# Altium schematic sheet MelansonTech Boost PSU_IsolatedShuntAmp.SchDoc
size B
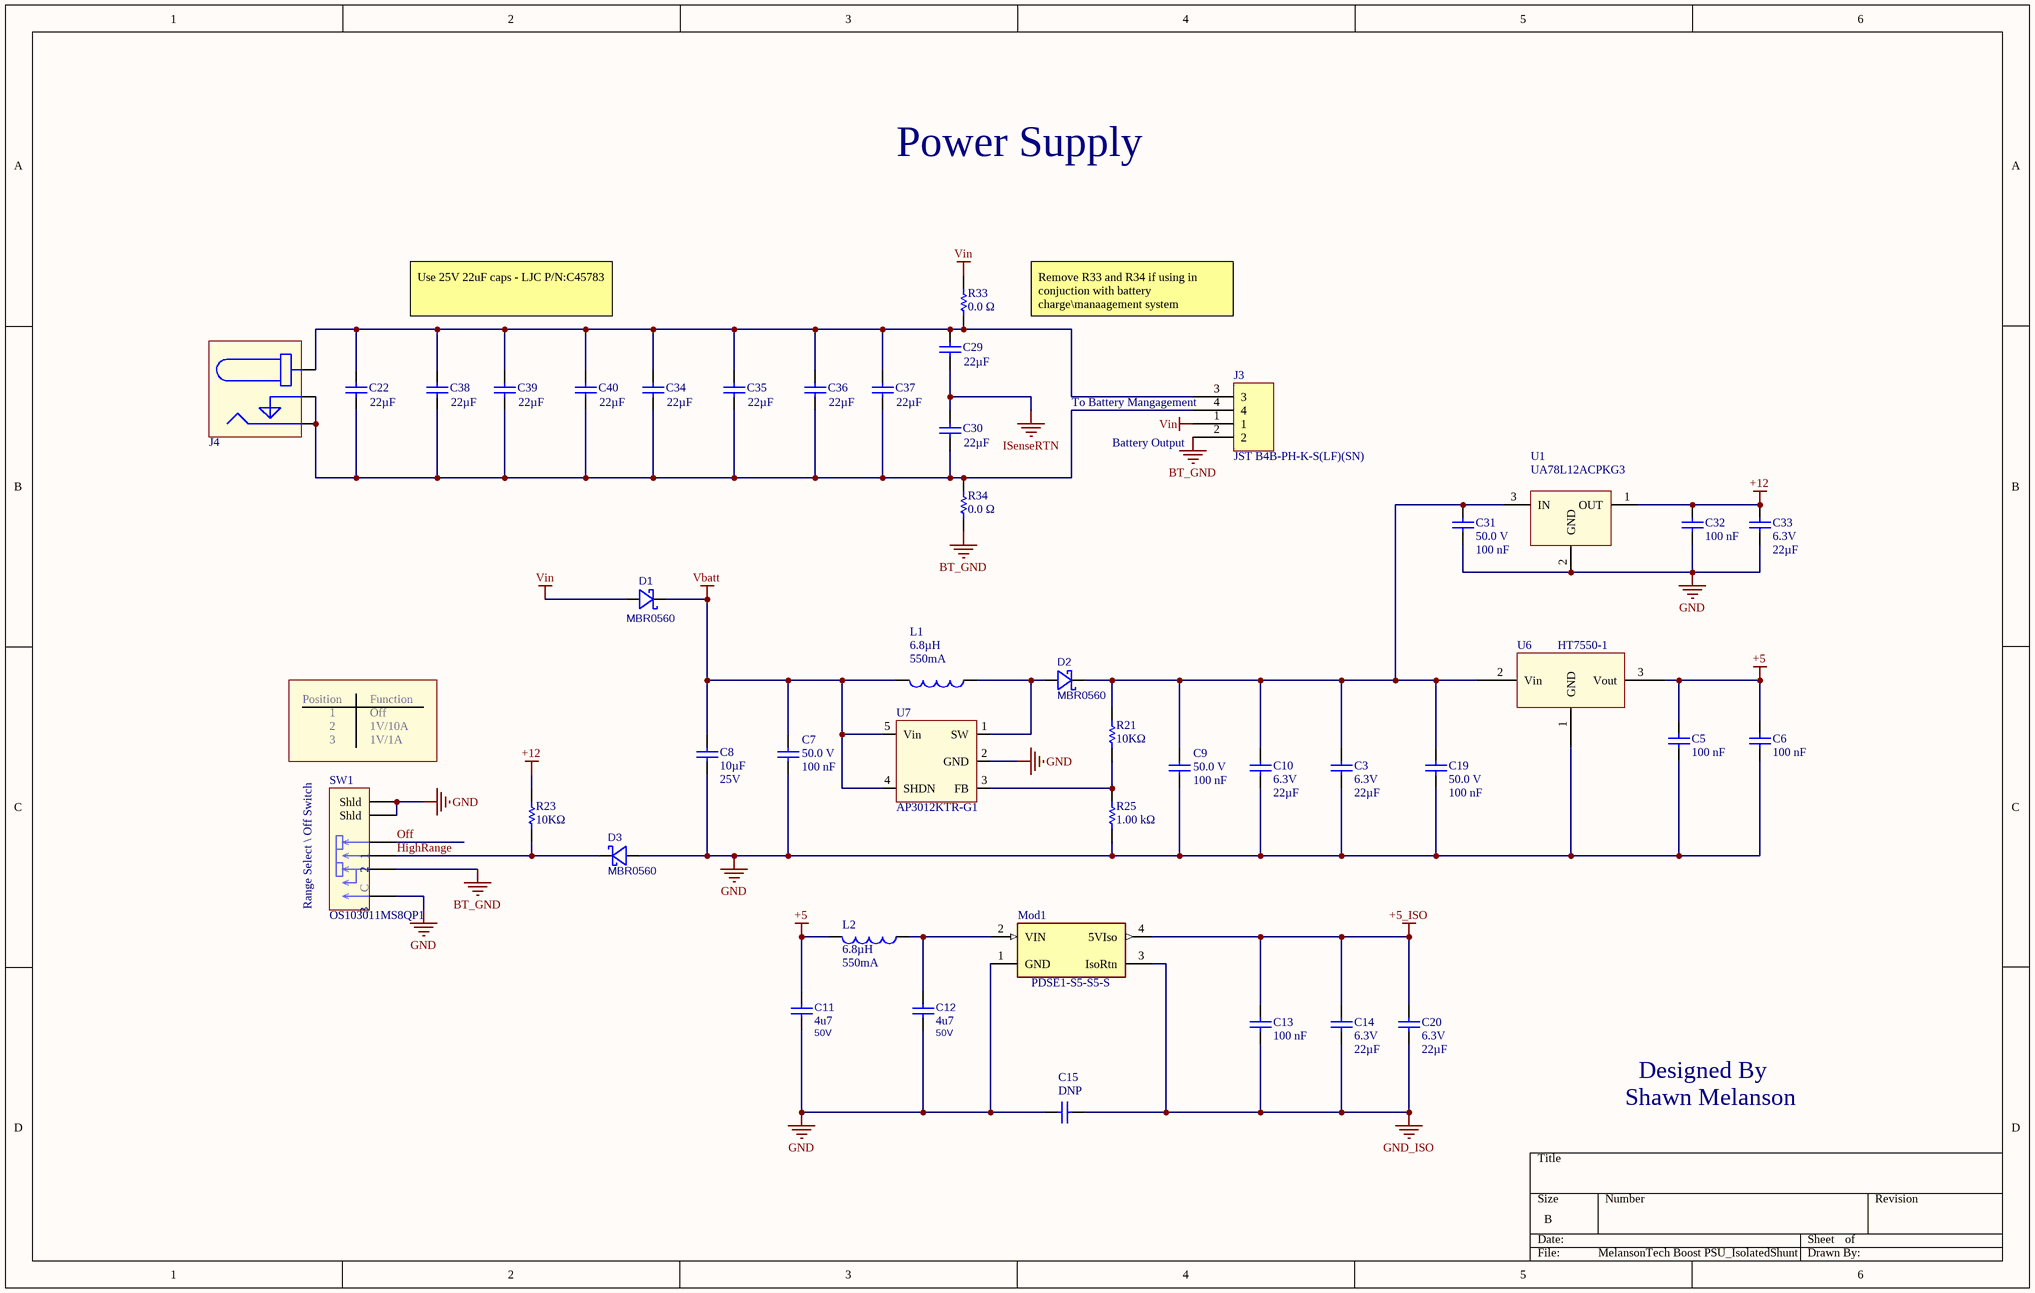
[diagram p0: MelansonTech Boost PSU_IsolatedShuntAmp.SchDoc]

## Parts
C3  Voltage - Rated: 6.3V  Capacitance: 22µF  [Cap,0805]  (hidden comment: CL21A226MQQNNNE)
C5  Capacitance: 100 nF  [CAP, 0805, HD]  (hidden comment: 08055C104JAT2A)
C6  Capacitance: 100 nF  [CAP, 0805, HD]  (hidden comment: 08055C104JAT2A)
C7  Voltage Rating (DC): 50.0 V  Capacitance: 100 nF  [Cap,0805]  (hidden comment: Cap)
C8  Capacitance: 10µF  Voltage - Rated: 25V  [Cap, 1206]  (hidden comment: C3216X7R1E106K160AB)
C9  Voltage Rating (DC): 50.0 V  Capacitance: 100 nF  [Cap,0805]  (hidden comment: Cap)
C10  Voltage - Rated: 6.3V  Capacitance: 22µF  [Cap,0805]  (hidden comment: CL21A226MQQNNNE)
C11  Capacitance: 4u7  Voltage: 50V  [Cap, 1206]  (hidden comment: CL31B475KBHNNNE)
C12  Capacitance: 4u7  Voltage: 50V  [Cap, 1206]  (hidden comment: CL31B475KBHNNNE)
C13  Capacitance: 100 nF  [CAP, 0805, HD]  (hidden comment: 08055C104JAT2A)
C14  Voltage - Rated: 6.3V  Capacitance: 22µF  [Cap,0805]  (hidden comment: CL21A226MQQNNNE)
C15  S102K33Y5PP63K5R  [Cap, 5mm Lead Spaceing, 4mm dai]  (value not drawn)
C19  Voltage Rating (DC): 50.0 V  Capacitance: 100 nF  [Cap,0805]  (hidden comment: Cap)
C20  Voltage - Rated: 6.3V  Capacitance: 22µF  [Cap,0805]  (hidden comment: CL21A226MQQNNNE)
C22  Capacitance: 22µF  [Cap,0805]  (hidden comment: CL21A226MQQNNNE)
C29  Capacitance: 22µF  [Cap,0805]  (hidden comment: CL21A226MQQNNNE)
C30  Capacitance: 22µF  [Cap,0805]  (hidden comment: CL21A226MQQNNNE)
C31  Voltage Rating (DC): 50.0 V  Capacitance: 100 nF  [Cap,0805]  (hidden comment: Cap)
C32  Capacitance: 100 nF  [CAP, 0805, HD]  (hidden comment: 08055C104JAT2A)
C33  Voltage - Rated: 6.3V  Capacitance: 22µF  [Cap,0805]  (hidden comment: CL21A226MQQNNNE)
C34  Capacitance: 22µF  [Cap,0805]  (hidden comment: CL21A226MQQNNNE)
C35  Capacitance: 22µF  [Cap,0805]  (hidden comment: CL21A226MQQNNNE)
C36  Capacitance: 22µF  [Cap,0805]  (hidden comment: CL21A226MQQNNNE)
C37  Capacitance: 22µF  [Cap,0805]  (hidden comment: CL21A226MQQNNNE)
C38  Capacitance: 22µF  [Cap,0805]  (hidden comment: CL21A226MQQNNNE)
C39  Capacitance: 22µF  [Cap,0805]  (hidden comment: CL21A226MQQNNNE)
C40  Capacitance: 22µF  [Cap,0805]  (hidden comment: CL21A226MQQNNNE)
D1  MBR0560  [SOD123]
D2  MBR0560  [SOD123]
D3  MBR0560  [SOD123]
J3  JST B4B-PH-K-S(LF)(SN)  [Conn, JST, 4 pin, 2mm spacing Right Angle]
J4  PJ-002A  [Connector,Barrel,2.1mm,5.5mm,DC power Jack]  (value not drawn)
L1  Inductance: 6.8µH  Current Rating (Amps): 550mA  [Ind, 0805]  (hidden comment: MLZ2012N6R8LT000)
L2  Inductance: 6.8µH  Current Rating (Amps): 550mA  [Ind, 0805]  (hidden comment: MLZ2012N6R8LT000)
Mod1  PDSE1-S5-S5-S  [CONV_PDSE1-S5-S5-S]
R21  Resistance: 10KΩ  [res, 0805, HD]  (hidden comment: Vishay / Dale CRCW080510K0FKTA)
R23  Resistance: 10KΩ  [res, 0805, HD]  (hidden comment: Vishay / Dale CRCW080510K0FKTA)
R25  Resistance: 1.00 kΩ  [res, 0805, HD]  (hidden comment: Vishay CRCW08051K00JNEA)
R33  Resistance: 0.0 Ω  [res, 0805, HD]  (hidden comment: CR0805-J/-000ELF)
R34  Resistance: 0.0 Ω  [res, 0805, HD]  (hidden comment: CR0805-J/-000ELF)
SW1  OS103011MS8QP1  [Switch,Slide,.SP3T, OS103011 -Side]
U1  UA78L12ACPKG3  [SOT89-3]
U6  HT7550-1  [SOT89-3]
U7  AP3012KTR-G1  [SOT23-5]

## Nets
+5: C5.2 C6.2 C11.2 L2.2 U6.3(Vout)
+5_ISO: C13.2 C14.2 C20.2 Mod1.4(5VIso)
+12: C32.2 C33.2 R23.1 U1.1(OUT)
BT_GND: J3.2 R34.2 SW1.2
GND: C3.1 C5.1 C6.1 C7.1 C8.1 C9.1 C10.1 C11.1 C12.1 C15.2 C19.1 C31.1 C32.1 C33.1 D3.2(A) Mod1.1(GND) R25.2 SW1.1 SW1.5(Shld) SW1.6(Shld) U1.2(GND) U6.1(GND) U7.2(GND)
GND_ISO: C13.1 C14.1 C15.1 C20.1 Mod1.3(IsoRtn)
ISenseRTN: C29.1 C30.2
Vbatt: C7.2 C8.2 D1.1(C) L1.2 U7.4(SHDN) U7.5(Vin)
Vin: D1.2(A) J3.1 R33.1
HighRange: D3.1(C) R23.2 SW1.3
Off: SW1.4
NetC3_2: C3.2 C9.2 C10.2 C19.2 C31.2 D2.1(C) R21.2 U1.3(IN) U6.2(Vin)
NetC12_2: C12.2 L2.1 Mod1.2(VIN)
NetC22_1: C22.1 C30.1 C34.1 C35.1 C36.1 C37.1 C38.1 C39.1 C40.1 J3.4 J4.2 J4.3 R34.1
NetC22_2: C22.2 C29.2 C34.2 C35.2 C36.2 C37.2 C38.2 C39.2 C40.2 J3.3 J4.1 R33.2
NetD2_2: D2.2(A) L1.1 U7.1(SW)
NetR21_1: R21.1 R25.1 U7.3(FB)

## Notes on the sheet
- Power Supply
- Use 25V 22uF caps - LJC P/N:C45783
- Remove R33 and R34 if using in conjuction with battery charge\manaagement system
- (near J3) To Battery Mangagement
- (near J3) Battery Output
- Position
- Function
- 1
- 2
- 3
- Off
- 1V/10A
- 1V/1A
- Range Select \ Off Switch
- (near C15) DNP
- Shawn Melanson
- Designed By
- (in symbol Switch,TH,Slide,SP3T,100MA,12V,OS103011MS8QP1) C

## Library data of the parts
C3 C10 C14 C20 C22 C29 C30 C33-C40 = Cap,0805,22uF,6.3V,X5R,±20%,CL21A226MQQNNNE: CAP CER 22UF 6.3V X5R 0805; Manufacturer: Samsung Electro-Mechanics; Detailed Description: 22 µF ±20% 6.3V Ceramic Capacitor X5R 0805 (2012 Metric); Tolerance: ±20%; mfg P/N: CL21A226MQQNNNE; Category: Capacitors  Ceramic Capacitors; Series: CL; Part Status: Active; Temperature Coefficient: X5R; Operating Temperature: -55°C ~ 85°C; Applications: General Purpose; Mounting Type: Surface Mount, MLCC; Package / Case: 0805 (2012 Metric); Size / Dimension: 0.079" L x 0.049" W (2.00mm x 1.25mm); Thickness (Max): 0.055" (1.40mm)
  C22 C29 C30 C34-C40: Voltage - Rated: 6.3V
C5 C6 C13 C32 = Cap,0805,100nf,50V,5%,08055C104JAT2A: Capacitor; Ceramic; Cap 0.1 uF; Tol 5%; Vol-Rtg 50 VDC; SMT; 0805; X7R; Tape & Reel; Lead-Free Status: Lead Free; Voltage Rating (DC): 50.0 V; Case/Package (SI): 2012; Insulation Resistance: 100 GΩ; Detailed Description: 0.1µF ±5% 50V Ceramic Capacitor X7R 0805 (2012 Metric); Mounting Style: Surface Mount; Packaging: Tape & Reel (TR), Cut Tape (CT); RoHS: Compliant; Size-Width: 1.24 mm; Case/Package: 0805; Number of Pins: 2; digikey url: http://www.digikey.ca/product-detail/en/avx-corporation/08055C104JAT2A/478-3352-1-ND/930144; REACH SVHC Compliance: No SVHC; Dielectric Characteristic: X7R; Capacitance Tolerance: ±5%; Size-Length: 2.01 mm; Size-Height: 710 µm; Size-Thickness: 940 µm; Manufacturer Part Number: 08055C104JAT2A; Octopart URL: http://octopart.com/08055c104jat2a-avx-55388010; Operating Temperature: -55°C ~ 125°C
C7 C9 C19 C31 = Cap,0805,100nf,50V,5%,08055C104JAT2A: Capacitor; Ceramic; Cap 0.1 uF; Tol 5%; Vol-Rtg 50 VDC; SMT; 0805; X7R; Tape & Reel; Lead-Free Status: Lead Free; Case/Package (SI): 2012; Insulation Resistance: 100 GΩ; Detailed Description: 0.1µF ±5% 50V Ceramic Capacitor X7R 0805 (2012 Metric); Mounting Style: Surface Mount; Packaging: Tape & Reel (TR), Cut Tape (CT); RoHS: Compliant; Size-Width: 1.24 mm; Case/Package: 0805; Number of Pins: 2; digikey url: http://www.digikey.ca/product-detail/en/avx-corporation/08055C104JAT2A/478-3352-1-ND/930144; REACH SVHC Compliance: No SVHC; Dielectric Characteristic: X7R; Capacitance Tolerance: ±5%; Size-Length: 2.01 mm; Size-Height: 710 µm; Size-Thickness: 940 µm; Manufacturer Part Number: 08055C104JAT2A; Octopart URL: http://octopart.com/08055c104jat2a-avx-55388010; Operating Temperature: -55°C ~ 125°C
C8 = CAP,1206,10uF,25V,C3216X7R1E106K160AB: 10µF ±10% 25V Ceramic Capacitor X7R 1206 (3216 Metric); Manufacturer: TDK Corporation; Features Low: ESL; mfg P/N: C3216X7R1E106K160AB; Tolerance: ±10%; Temperature Coefficient: X7R; Operating Temperature: -55°C ~ 125°C; Applications: General Purpose; Mounting Type: Surface Mount, MLCC; Package / Case: 1206 (3216 Metric); Size / Dimension: 0.126" L x 0.063" W (3.20mm x 1.60mm); Thickness (Max): 0.075" (1.90mm); Supplier 1: Digi-Key; Supplier Part Number 1: 445-7705-1-ND
C11 C12 = Cap,1206,4.7uF,10%,50V,CL31B475KBHNNNE: Cap,SMD,MLCC,4u7,50V,X7R,10%,1206; Manufacturer: Samsung; Manufacturer P/N: CL31B475KBHNNNE; Tolerance: 10%; Package: 1206; Supplier 1: LCSC; Supplier Part Number 1: C51205; Supplier 2: Digi-Key; Supplier Part Number 2: 1276-2789-1-ND
C15 = Cap,TH,Ceramic,5mm Spacing,1nF,2kV, S102K33Y5PP63K5R: CAP CER 1000PF 2KV Y5P RADIAL; Manufacturer: Vishay BC Components; Detailed Description: 1000pF ±10% 2000V (2kV) Ceramic Capacitor Y5P (B) Radial, Disc; Tolerance: ±10%; Temperature Coefficient: Y5P (B); Voltage - Rated: 2000V (2kV); Capacitance: 1nF; mfg P/N: S102K33Y5PP63K5R; Category: Capacitors  Ceramic Capacitors; Series: S; Part Status: Active; Operating Temperature: -30°C ~ 125°C; Applications: General Purpose; Mounting Type: Through Hole; Package / Case: Radial, Disc; Size / Dimension: 0.335"" Dia (8.50mm); Height - Seated (Max): 0.492"" (12.50mm); Lead Spacing: 0.197"" (5.00mm); Lead Style: Formed Leads - Kinked
D1-D3 = Diode,SOD123,Shottky,60V,0.5A,MBR0560: Dio,Sig,Schtky,0.5A,60V,SOD123; Manufacturer: MCC; mfg P/N: MBR0560-TP; Details: 700mV @ 500mA, 200µA @ 60V,30pF @ 4V, 1MHz; Not Stuffed: N/S; Fast Supplier: Digi-Key; Current: 0.5A; Package: SOD123; Voltage: 60V; Supplier 1: Digi-Key; Supplier Part Number 1: MBR0560TPMSCT-ND; Supplier 2: LCSC; Supplier Part Number 2: C150515
J3 = Conntector, though hole, JST, 4pin, 2mm,B4B-PH-K-S(LF)(SN): PH Series 4 Position 2 mm Pitch Through Hole Crimp Top Entry Shrouded Header; Voltage Rating (AC): 100 V; Insulation Resistance: 1.00 MΩ; Number of Contacts: 4; Contact Resistance: 10.0 mΩ; REACH SVHC Compliance: No SVHC; Mounting Style: Through Hole, Vertical; Manufacturer Part Number: B4B-PH-K-S(LF)(SN); Size-Width: 4.50 mm; Number of Positions: 4; Size-Height: 6.00 mm; Size-Length: 9.90 mm; Supplier 1: Farnell; Supplier 2: Newark; Supplier 3: Digi-Key; Supplier 4: Digi-Key; Supplier Part Number 4: 455-1706-ND
J4 = Connector,Barrel,ID 2.1mm,OD 5.5mm,Power Connect, PJ-002A: Power Barrel Connector Jack 2.10mm ID (0.083"), 5.50mm OD (0.217") Through Hole, Right Angle; Manufacturer: CUI Inc.; Actual Diameter: 0.079" (2.00mm ID), 0.256" (6.50mm OD); Number of Positions/Contacts: 2 Conductors, 3 Contacts; Mating Length/Depth: 0.354" (9.00mm); Dielectric Material: Polybutylene Terephthalate (PBT); Internal Switch(s): Does Not Contain Switch; Shielding: Unshielded; Voltage - Rated: 24VDC; Current Rating (Amps): 2.5A; Material Flammability Rating: UL94 V-0; Body Color: Black; mfg P\N: PJ-002A; Industry Recognized Mating Diameter: 2.10mm ID (0.083"), 5.50mm OD (0.217"); Connector Type: Jack; Mounting Type: Through Hole, Right Angle; Termination: Solder Eyelet(s); Contact Material - Plating: Tin; Operating Temperature: -25°C ~ 85°C; Contact Material: Brass, Copper Alloy; Supplier 1: Digi-Key; Supplier Part Number 1: CP-002A-ND
L1 L2 = Ind,0805,6.8uH,550mA,0.25Ω, MLZ2012N6R8LT000: FIXED IND 6.8UH 550MA 250 MOHM; Manufacturer: TDK Corporation; Detailed Description: 6.8µH Shielded Multilayer Inductor 550mA 250mOhm 0805 (2012 Metric); Type: Multilayer; Material - Core: Ferrite; Tolerance: ±20%; Current - Saturation: 110mA; Shielding: Shielded; Frequency - Self Resonant: 60MHz; Inductance Frequency - Test: 2MHz; mfg P/N: MLZ2012N6R8LT000; Category: Inductors, Coils, Chokes  Fixed Inductors; Series: MLZ; Part Status: Active; DC Resistance (DCR): 250mOhm; Operating Temperature: -55°C ~ 125°C; Mounting Type: Surface Mount; Package / Case: 0805 (2012 Metric); Supplier Device Package: 0805 (2012 Metric); Size / Dimension: 0.079"" L x 0.049"" W (2.00mm x 1.25mm); Height - Seated (Max): 0.041"" (1.05mm); Supplier 1: Digi-Key; Supplier Part Number 1: 445-6761-1-ND; Supplier 2: LCSC; Supplier Part Number 2: C82157
Mod1 = Mod,PSU,4.5-5.5Vin,5Vout,1W, PDSE1-S5-S5-S: DC-DC ISOLATED, 1 W, 4.5-5.5 VDC; Manufacturer: CUI Inc.; Detailed Description: Isolated Module DC DC Converter 1 Output 5V    200mA 4.5V - 5.5V Input; Voltage - Isolation: 3kV; Voltage - Input (Min): 4.5V; Voltage - Input (Max): 5.5V; Voltage - Output 1: 5V; Current - Output (Max): 200mA; Efficiency: 82%; Approval Agency: CE, cURus; Number of Outputs: 1; Power (Watts): 1W; mfg P/N: PDSE1-S5-S5-S; Series: PDSE1-S (1W); Category: Power Supplies - Board Mount  DC DC Converters; Part Status: Active; Type: Isolated Module; Applications: ITE (Commercial); Features: SCP; Operating Temperature: -40°C ~ 105°C (With Derating); Mounting Type: Through Hole; Package / Case: 4-SIP Module; Size / Dimension: 0.46"" L x 0.24"" W x 0.40"" H (11.6mm x 6.0mm x 10.2mm); Supplier 1: Digi-Key; Supplier Part Number 1: 102-6291-ND
R21 R23 = Res,0805,10.0kΩ,1%,100 ppm,CRCW080510K0FKTA: RES SMD 10K OHM 1% 1/8W 0805; Temperature Coefficient: 100.0 ppm/C; Lead-Free Status: Contains Lead; Voltage Rating (DC): 150.0 V; Power Rating: 0.125 W; Case/Package (SI): 2012; Size-Width: 0.00125 m; Resistance Tolerance: 1%; Size-Length: 0.002 m; RoHS: Non-Compliant; Power Dissipation: 0.125 W; Number of Pins: 2; REACH SVHC Compliance: No SVHC; Size-Height: 0.00045 m; Case/Package: 0805; Mounting Style: Surface Mount; Supplier 1: Digi-Key; Supplier Part Number 1: 541-3016-1-ND
R25 = Res,0805,1.00 kΩ,5%,200ppm,CRCW08051K00JNEA: Res Thick Film 0805 1K Ohm 5% 0.125W(1/8W) ±200ppm/C Molded SMD Automotive Paper T/R; Power Rating: 125 mW; Case/Package (SI): 2012; Lead-Free Status: Lead Free; Temperature Coefficient: 200 ppm/°C; Voltage Rating (DC): 150 V; Size-Width: 1.25 mm; Mounting Style: Surface Mount; REACH SVHC Compliance: No SVHC; Manufacturer Part Number: CRCW08051K00JNEA; Number of Pins: 2; Size-Height: 450 µm; Packaging: Tape & Reel (TR), Cut Tape (CT); RoHS: Compliant; Resistance Tolerance: ±5%; Case/Package: 0805; Size-Length: 2.00 mm; Supplier 1: Digi-Key; Supplier Part Number 1: 541-1.0KADKR-ND; Supplier 2: Digi-Key; Supplier Part Number 2: 541-1.0KACT-ND
R33 R34 = Res,0805,0.0Ω,150V, CR0805-J/-000ELF: RES SMD 0 OHM JUMPER 1/8W 0805; Lead-Free Status: Lead Free; Power Rating: 0.125 W; Voltage Rating (DC): 150.0 V; Detailed Description: 0 Ohms Jumper 0.125W, 1/8W Chip Resistor 0805 (2012 Metric) Moisture Resistant Thick Film; Categories: Resistors   Chip Resistor - Surface Mount; Case/Package: 0805; Number of Pins: 2; RoHS: Compliant; Tolerance: Jumper; Composition: Thick Film; Operating Temperature: -55°C ~ 155°C; Base Part Number: CR0805; Supplier 1: Digi-Key; Supplier Part Number 1: CR0805-J/-000ELFCT-ND; Supplier 2: Digi-Key; Supplier Part Number 2: CR0805-J/-000ELFDKR-ND
SW1 = Switch,TH,Slide,SP3T,100MA,12V,OS103011MS8QP1: SWITCH SLIDE SP3T 100MA 12V; Manufacturer: C&K; Detailed Description: Slide Switch SP3T Through Hole; Switch Function: On-On-On; Current Rating (Amps): 100mA (DC); Actuator Type: Standard; Actuator Length: 4.00mm; Actuator Material: Polyoxymethylene (Acetal) (POM); Switch Travel: 2.00mm; Mechanical Life: 10,000 Cycles; mfg P/N: OS103011MS8QP1; Part Status: Active; Circuit: SP3T; Voltage Rating - DC: 12V; Contact Material: Copper Alloy; Contact Finish: Silver; Mounting Type: Through Hole; Termination Style: PC Pin; Features: Epoxy Sealed Terminals; Operating Temperature: -30°C ~ 70°C; Electrical Life: 10,000 Cycles; Supplier 1: Digi-Key; Supplier Part Number 1: CKN9543-ND; Supplier 2: LCSC; Supplier Part Number 2: C221831
U1 = Reg,Linear,Pos,Fixed,12Vout,27Vin,100mA,UA78L12ACPKG3: IC REG LINEAR 12V 100MA SOT89-3; Manufacturer: Texas Instruments; Detailed Description: Linear Voltage Regulator IC Positive Fixed 1 Output 100mA SOT-89-3; Output Configuration: Positive; Output Type: Fixed; Voltage - Input (Max): 27V; Voltage Dropout (Max): 1.7V @ 40mA; PSRR: 42dB (120Hz); Protection Features: Over Current, Over Temperature, Reverse Polarity, Short Circuit; Number of Regulators: 1; mfg P/N: UA78L12ACPKG3; Category: Integrated Circuits (ICs)  PMIC - Voltage Regulators - Linear; Part Status: Active; Voltage - Output (Min/Fixed): 12V; Current - Output: 100mA; Operating Temperature: 0°C ~ 125°C; Mounting Type: Surface Mount; Package / Case: TO-243AA; Supplier Device Package: SOT-89-3; Base Product Number: UA78L12; Supplier 1: Digi-Key; Supplier Part Number 1: 296-50454-6-ND; Supplier 2: Mouser; Supplier Part Number 2: 595-UA78L12ACPKG3; Supplier 3: Arrow Electronics; Supplier Part Number 3: UA78L12ACPKG3
U6 = Reg,Linear,Fixed,SOT-89-3,30Vin,5Vout,150mA,HT7550-1: LOW DROPOUT REGULATORS(LDO) POSITIVE FIXED 55MV @ 1MA 30V 5V 150MA SOT-89(SOT-89-3) ROHS; Manufacturer: Holtek Semicon; Input Voltage (Max): 30Vdc; Output voltage accuracy: tolerance ±3%; Quiescent current: 2.5μA; Output Voltage: 5Vdc; LCSC Part #: C16106; Package: SOT-89-3; Output Current (Max): 150mA; mfg P/N: HT7550-1
U7 = Reg,Switching,Boost,2.6-16Vin,29Vout,0.5A, AP3012KTR-G1: IC REG BOOST ADJ 500MA SOT23-5; Manufacturer: Diodes Incorporated; Detailed Description: Boost Switching Regulator IC Positive Adjustable 1.25V 1 Output 500mA (Switch) SC-74A, SOT-753; Function: Step-Up; Output Configuration: Positive; Output Type: Adjustable; Number of Outputs: 1; Voltage - Input (Min): 2.6V; Voltage - Input (Max): 16V; Voltage - Output (Min/Fixed): 1.25V; Voltage - Output (Max): 29V; Current - Output 500mA: (Switch); Frequency - Switching: 1.5MHz; S ynchronous Rectifier: No; Part Status: Active; Topology: Boost; Operating Temperature: -40°C ~ 85°C (TA); Mounting Type: Surface Mount; Package / Case: SC-74A, SOT-753; Supplier Device: Package SOT-23-5; Supplier 1: Digi-Key; Supplier Part Number 1: AP3012KTR-G1DICT-ND; Supplier 2: LCSC; Supplier Part Number 2: C102618; mfg P/N: AP3012KTR-G1